# Altium project Controller_PCB_Project.PrjPCB
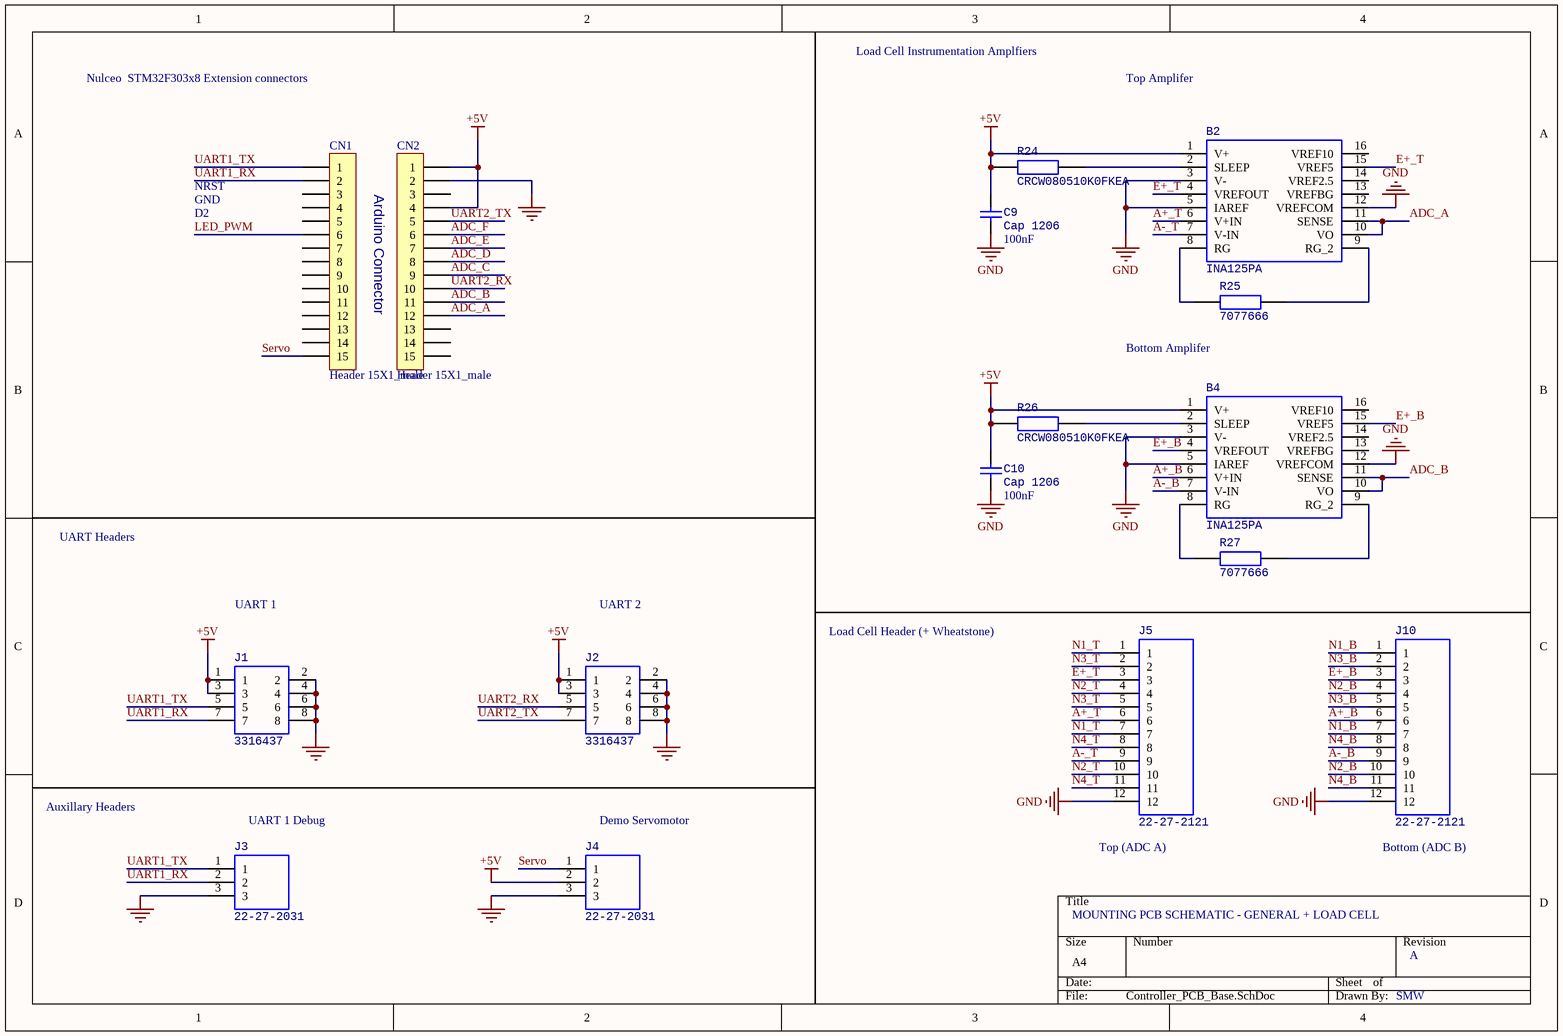
[diagram p0: Controller_PCB_Base.SchDoc]
3 sheets, 75 parts. Net scope: global (net labels, ports and power ports of the same name join across sheets).
Board file: Controller_PCB.PcbDoc
Sheets:
  Controller_PCB_Base.SchDoc
  Controller_PCB_LED.SchDoc
  Controller_PCB_OPAMP.SchDoc

## Sheet Controller_PCB_Base.SchDoc
size A4

### Parts
B2  INA125PA  [DIP254P762X508-16]
B4  INA125PA  [DIP254P762X508-16]
C9  Cap 1206  value 100nF  [C1206]
C10  Cap 1206  value 100nF  [C1206]
CN1  Header 15X1_male  [HDR_1x15_2R54_V_F]
CN2  Header 15X1_male  [HDR_1x15_2R54_V_F]
J1  3316437  [RJ45-8]
J2  3316437  [RJ45-8]
J3  22-27-2031  [SHDR3W64P0X254_1X3_762X580X1170P]
J4  22-27-2031  [SHDR3W64P0X254_1X3_762X580X1170P]
J5  22-27-2121  [HDRV12W64P0X254_1X12_3048X580X1170P]
J10  22-27-2121  [HDRV12W64P0X254_1X12_3048X580X1170P]
R24  CRCW080510K0FKEA  [RESC2012X50N]
R25  7077666  [RESAD1550W58L630D230]
R26  CRCW080510K0FKEA  [RESC2012X50N]
R27  7077666  [RESAD1550W58L630D230]

### Nets
+5V: B2.1(V+) B4.1(V+) C9.2 C10.2 CN2.1 CN2.4 J1.1 J1.3 J2.1 J2.3 J4.2 R24.1 R26.1
GND: B2.3(V-) B2.5(IAREF) B2.12(VREFCOM) B4.3(V-) B4.5(IAREF) B4.12(VREFCOM) C9.1 C10.1 CN2.2 J1.2 J1.4 J1.6 J1.8 J2.2 J2.4 J2.6 J2.8 J3.3 J4.3 J5.12 J10.12
A+_B: B4.6(V+IN) J10.6
A+_T: B2.6(V+IN) J5.6
A-_B: B4.7(V-IN) J10.9
A-_T: B2.7(V-IN) J5.9
ADC_A: B2.10(VO) B2.11(SENSE) CN2.12
ADC_B: B4.10(VO) B4.11(SENSE) CN2.11
ADC_C: CN2.9
ADC_D: CN2.8
ADC_E: CN2.7
ADC_F: CN2.6
E+_B: B4.4(VREFOUT) B4.15(VREF5) J10.3
E+_T: B2.4(VREFOUT) B2.15(VREF5) J5.3
LED_PWM: CN1.6
N1_B: J10.1 J10.7
N1_T: J5.1 J5.7
N2_B: J10.4 J10.10
N2_T: J5.4 J5.10
N3_B: J10.2 J10.5
N3_T: J5.2 J5.5
N4_B: J10.8 J10.11
N4_T: J5.8 J5.11
Servo: CN1.15 J4.1
UART1_RX: CN1.2 J1.7 J3.2
UART1_TX: CN1.1 J1.5 J3.1
UART2_RX: CN2.10 J2.5
UART2_TX: CN2.5 J2.7
NetB2_2: B2.2(SLEEP) R24.2
NetB2_8: B2.8(RG) R25.1
NetB2_9: B2.9(RG_2) R25.2
NetB4_2: B4.2(SLEEP) R26.2
NetB4_8: B4.8(RG) R27.1
NetB4_9: B4.9(RG_2) R27.2

Not connected (* = marked no-connect by the designer): B2 13(VREFBG) 14(VREF2.5) 16(VREF10); B4 13(VREFBG) 14(VREF2.5) 16(VREF10); CN1 3 4 5 7 8 9 10 11 12 13 14; CN2 3 13 14 15

### Notes on the sheet
- Nulceo  STM32F303x8 Extension connectors
- Load Cell Instrumentation Amplfiers
- Top Amplifer
- NRST
- GND
- D2
- Arduino Connector
- Bottom Amplifer
- UART Headers
- UART 1
- UART 2
- Load Cell Header (+ Wheatstone)
- Auxillary Headers
- (near J3) UART 1 Debug
- (near J4) Demo Servomotor
- (near J5) Top (ADC A)
- (near J10) Bottom (ADC B)
- MOUNTING PCB SCHEMATIC - GENERAL + LOAD CELL
- A
- SMW

### Library data of the parts
B2 B4 = INA125PA: Instrumentation Amplifier with Precision Voltage Reference; Manufacturer_Name: Texas Instruments; RS Part Number: 2521593P; Manufacturer_Part_Number: INA125PA; Datasheet Link: http://uk.rs-online.com/web/p/products/2521593P
C9 C10 = Cap Semi: Capacitor (Semiconductor SIM Model); Published: 8-Jun-2000; LatestRevisionDate: 29-May-2009; LatestRevisionNote: IPC-7351 Footprint Added.; PackageReference: C1206; Publisher: Altium Limited; PackageDescription: Chip Capacitor
CN1 CN2 = Header 15X1_Female_1: Header, 10-Pin, Single row,female; LatestRevisionDate: 17-Jul-2002; LatestRevisionNote: Re-released for DXP Platform.; Publisher: Altium Limited
J1 J2 = 3316437: 8/8 way r/a PCB lowprofile data skt,1.5A RS Pro Female Cat5 RJ45 Connector, Unshielded, Right Angle, PCB Mount Mount,; Manufacturer_Name: RS Components; Allied_Number: 70643325; RS Part Number: 3316437; Manufacturer_Part_Number: 3316437; Datasheet Link: http://uk.rs-online.com/web/p/products/3316437
J3 J4 = 22-27-2031: 3way straight PCB header w/friction lock Molex KK Series, Series Number 6410, 2.54mm Pitch 3 Way 1 Row Straight PCB Header, Solder Termination, 4A; Allied_Number: 70190935; Geometry.Height: 11.7mm; RS Part Number: 1707102; Manufacturer_Name: Molex; Manufacturer_Part_Number: 22-27-2031; Datasheet Link: http://uk.rs-online.com/web/p/products/1707102
J5 J10 = 22-27-2121: 12way straightPCB header w/friction lock Molex KK Series, Series Number 6410, 2.54mm Pitch 12 Way 1 Row Straight PCB Header, Solder Termination, 4A; Allied_Number: 70373056; Geometry.Height: 11.7mm; RS Part Number: 1707108; Manufacturer_Name: Molex; Manufacturer_Part_Number: 22-27-2121; Datasheet Link: http://uk.rs-online.com/web/p/products/1707108
R24 R26 = CRCW080510K0FKEA: CRCW0805 Resistor T/R 0.125W,1%,10K Vishay CRCW Series Thick Film Surface Mount Resistor 0805 Case 10k 1% 0.125W 100ppm/C; Allied_Number: 70203987; Geometry.Height: 0.5mm; RS Part Number: 1694499; Manufacturer_Name: Vishay; Manufacturer_Part_Number: CRCW080510K0FKEA; Datasheet Link: http://uk.rs-online.com/web/p/products/1694499
R25 R27 = 7077666: RS Pro RS Series Axial Carbon Resistor 1k 5% 0.25W -500  +350ppm/C; Manufacturer_Name: RS Components; RS Part Number: 7077666; Manufacturer_Part_Number: 7077666; Datasheet Link: https://componentsearchengine.com/Datasheets/3/7077666.pdf

## Sheet Controller_PCB_LED.SchDoc
size A4
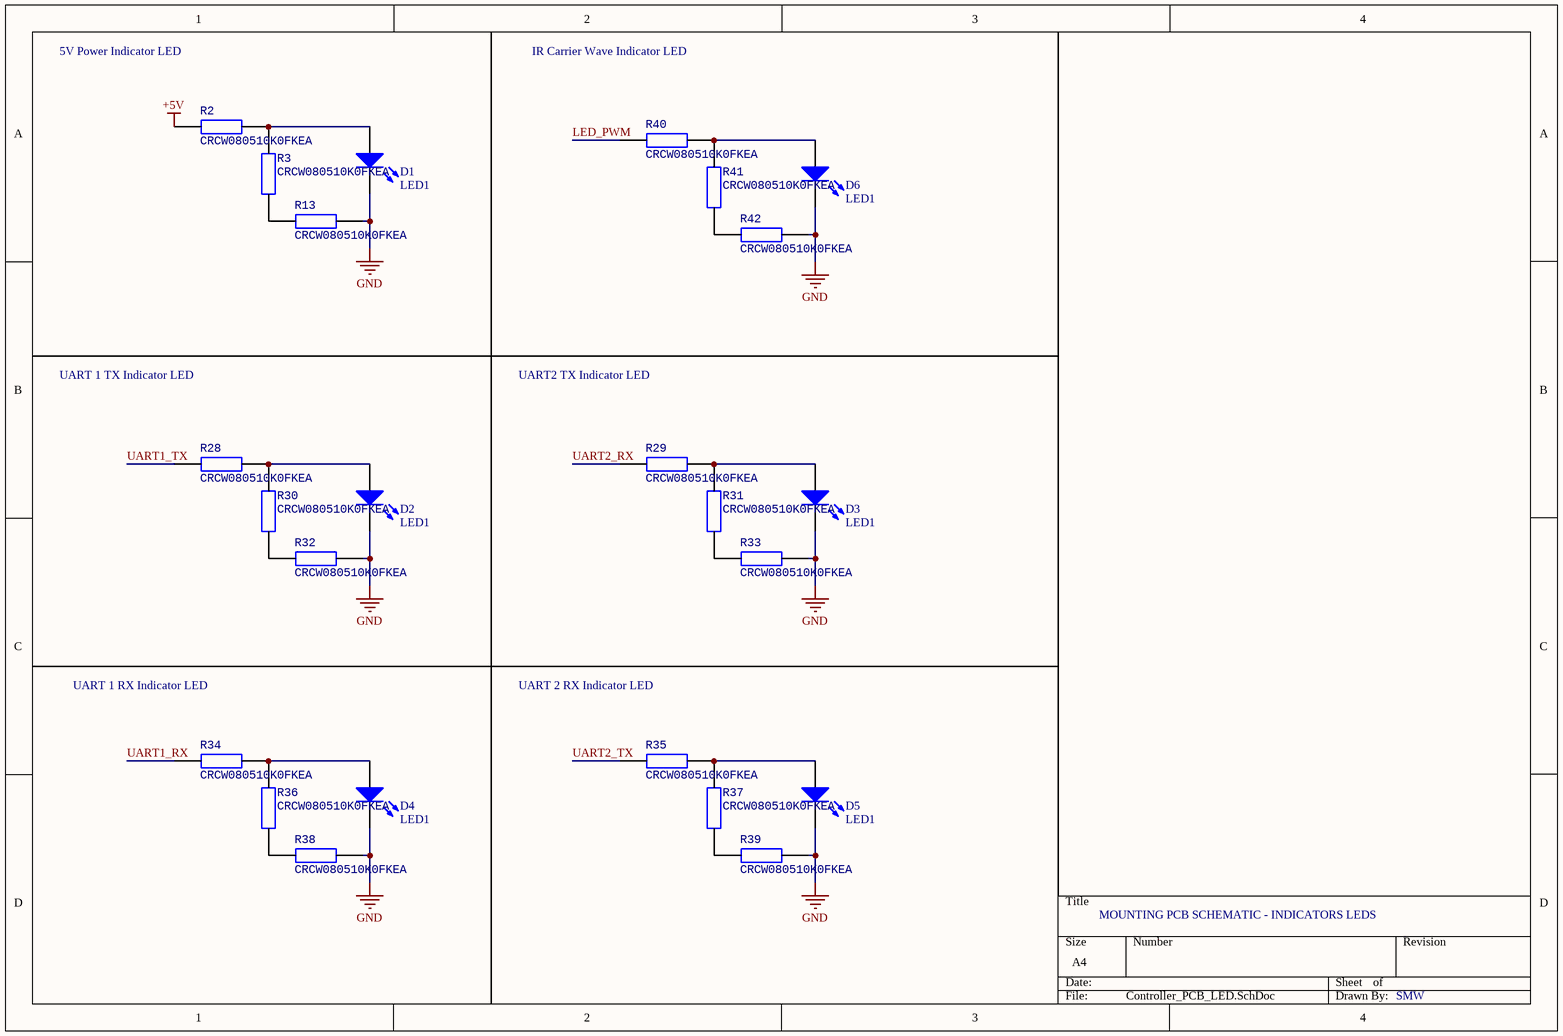
[diagram p1: Controller_PCB_LED.SchDoc]

### Parts
D1  LED1  [L0603]
D2  LED1  [L0603]
D3  LED1  [L0603]
D4  LED1  [L0603]
D5  LED1  [L0603]
D6  LED1  [L0603]
R2  CRCW080510K0FKEA  [RESC2012X50N]
R3  CRCW080510K0FKEA  [RESC2012X50N]
R13  CRCW080510K0FKEA  [RESC2012X50N]
R28  CRCW080510K0FKEA  [RESC2012X50N]
R29  CRCW080510K0FKEA  [RESC2012X50N]
R30  CRCW080510K0FKEA  [RESC2012X50N]
R31  CRCW080510K0FKEA  [RESC2012X50N]
R32  CRCW080510K0FKEA  [RESC2012X50N]
R33  CRCW080510K0FKEA  [RESC2012X50N]
R34  CRCW080510K0FKEA  [RESC2012X50N]
R35  CRCW080510K0FKEA  [RESC2012X50N]
R36  CRCW080510K0FKEA  [RESC2012X50N]
R37  CRCW080510K0FKEA  [RESC2012X50N]
R38  CRCW080510K0FKEA  [RESC2012X50N]
R39  CRCW080510K0FKEA  [RESC2012X50N]
R40  CRCW080510K0FKEA  [RESC2012X50N]
R41  CRCW080510K0FKEA  [RESC2012X50N]
R42  CRCW080510K0FKEA  [RESC2012X50N]

### Nets
+5V: R2.1
GND: D1.2(K) D2.2(K) D3.2(K) D4.2(K) D5.2(K) D6.2(K) R13.1 R32.1 R33.1 R38.1 R39.1 R42.1
LED_PWM: R40.1
UART1_RX: R34.1
UART1_TX: R28.1
UART2_RX: R29.1
UART2_TX: R35.1
NetD1_1: D1.1(A) R2.2 R3.2
NetD2_1: D2.1(A) R28.2 R30.2
NetD3_1: D3.1(A) R29.2 R31.2
NetD4_1: D4.1(A) R34.2 R36.2
NetD5_1: D5.1(A) R35.2 R37.2
NetD6_1: D6.1(A) R40.2 R41.2
NetR3_1: R3.1 R13.2
NetR30_1: R30.1 R32.2
NetR31_1: R31.1 R33.2
NetR36_1: R36.1 R38.2
NetR37_1: R37.1 R39.2
NetR41_1: R41.1 R42.2

### Notes on the sheet
- 5V Power Indicator LED
- IR Carrier Wave Indicator LED
- UART 1 TX Indicator LED
- UART2 TX Indicator LED
- UART 1 RX Indicator LED
- UART 2 RX Indicator LED
- MOUNTING PCB SCHEMATIC - INDICATORS LEDS
- SMW

### Library data of the parts
D1-D6 = LED1: Typical RED GaAs LED; Published: 8-Jun-2000; LatestRevisionDate: 08-Jul-2005; LatestRevisionNote: Mech Layer 1 removed.; PackageReference: LED-1; Publisher: Altium Limited; PackageDescription: LED; 2 Leads
R2 R3 R13 R28-R42 = CRCW080510K0FKEA: as R24 on sheet Controller_PCB_Base; RS Part Number: 1694499; Manufacturer_Name: Vishay; Manufacturer_Part_Number: CRCW080510K0FKEA; Datasheet Link: http://uk.rs-online.com/web/p/products/1694499

## Sheet Controller_PCB_OPAMP.SchDoc
size A4
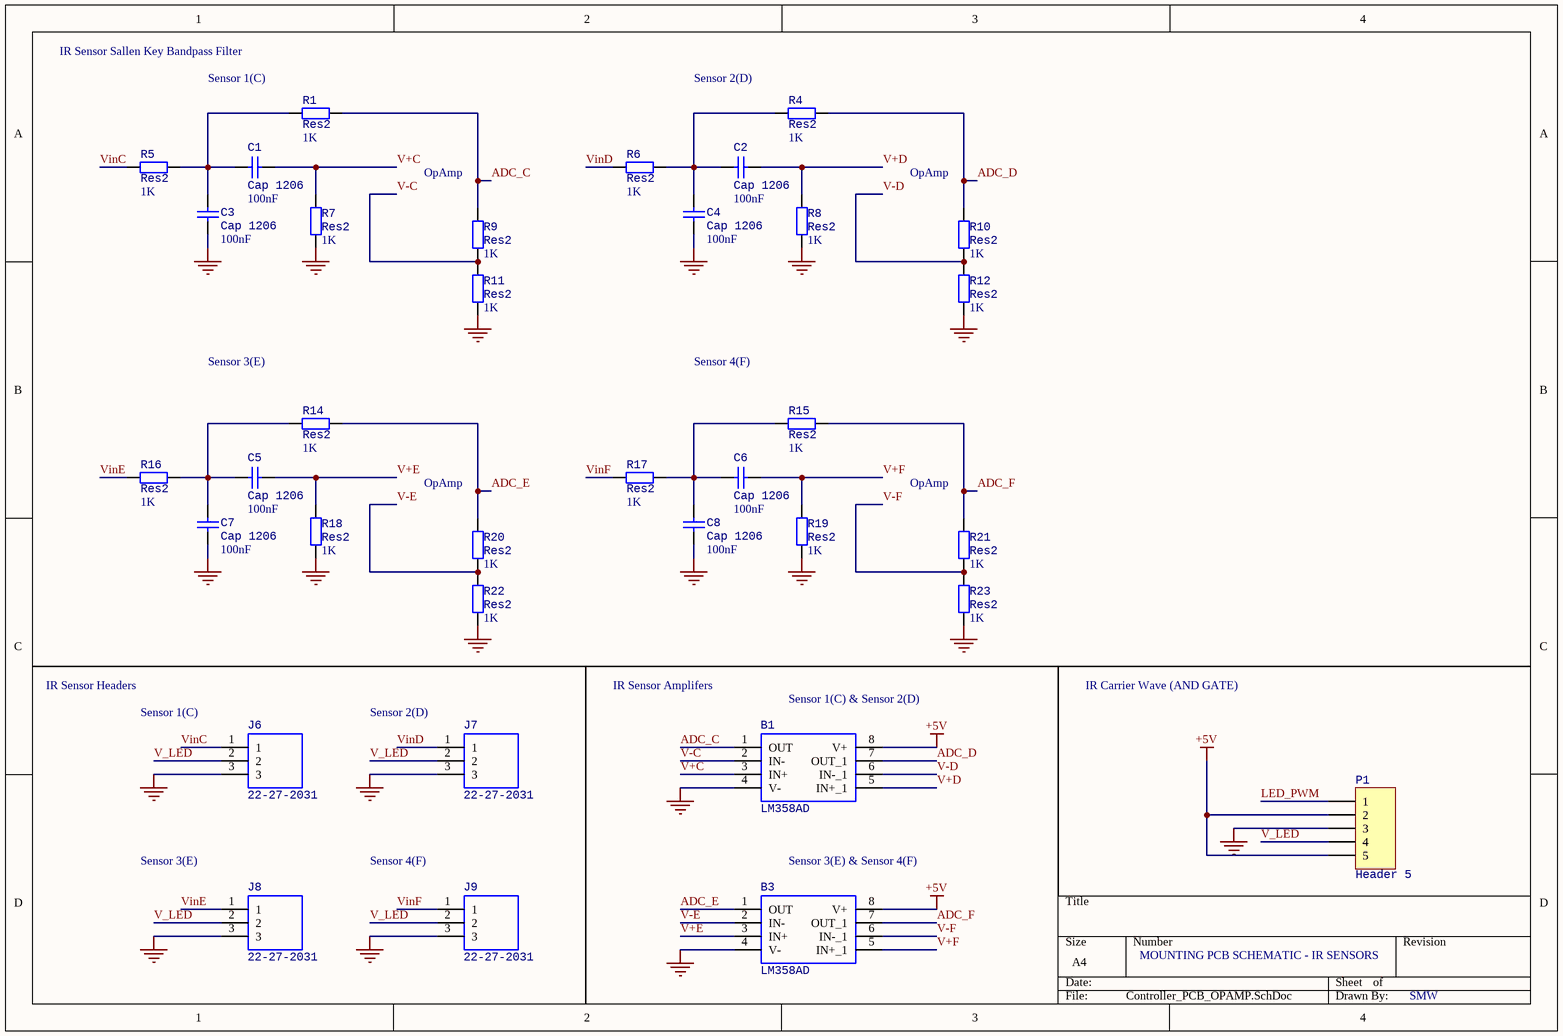
[diagram p2: Controller_PCB_OPAMP.SchDoc]

### Parts
B1  LM358AD  [SOIC127P600X175-8N]
B3  LM358AD  [SOIC127P600X175-8N]
C1  Cap 1206  value 100nF  [C1206]
C2  Cap 1206  value 100nF  [C1206]
C3  Cap 1206  value 100nF  [C1206]
C4  Cap 1206  value 100nF  [C1206]
C5  Cap 1206  value 100nF  [C1206]
C6  Cap 1206  value 100nF  [C1206]
C7  Cap 1206  value 100nF  [C1206]
C8  Cap 1206  value 100nF  [C1206]
J6  22-27-2031  [SHDR3W64P0X254_1X3_762X580X1170P]
J7  22-27-2031  [SHDR3W64P0X254_1X3_762X580X1170P]
J8  22-27-2031  [SHDR3W64P0X254_1X3_762X580X1170P]
J9  22-27-2031  [SHDR3W64P0X254_1X3_762X580X1170P]
P1  Header 5  [SOT353-1]
R1  Res2  value 1K  [C1206]
R4  Res2  value 1K  [C1206]
R5  Res2  value 1K  [C1206]
R6  Res2  value 1K  [C1206]
R7  Res2  value 1K  [C1206]
R8  Res2  value 1K  [C1206]
R9  Res2  value 1K  [C1206]
R10  Res2  value 1K  [C1206]
R11  Res2  value 1K  [C1206]
R12  Res2  value 1K  [C1206]
R14  Res2  value 1K  [C1206]
R15  Res2  value 1K  [C1206]
R16  Res2  value 1K  [C1206]
R17  Res2  value 1K  [C1206]
R18  Res2  value 1K  [C1206]
R19  Res2  value 1K  [C1206]
R20  Res2  value 1K  [C1206]
R21  Res2  value 1K  [C1206]
R22  Res2  value 1K  [C1206]
R23  Res2  value 1K  [C1206]

### Nets
+5V: B1.8(V+) B3.8(V+) P1.2 P1.5
GND: B1.4(V-) B3.4(V-) C3.1 C4.1 C7.1 C8.1 J6.3 J7.3 J8.3 J9.3 P1.3 R7.1 R8.1 R11.1 R12.1 R18.1 R19.1 R22.1 R23.1
ADC_C: B1.1(OUT) R1.2 R9.2
ADC_D: B1.7(OUT_1) R4.2 R10.2
ADC_E: B3.1(OUT) R14.2 R20.2
ADC_F: B3.7(OUT_1) R15.2 R21.2
LED_PWM: P1.1
V+C: B1.3(IN+) C1.1 R7.2
V+D: B1.5(IN+_1) C2.1 R8.2
V+E: B3.3(IN+) C5.1 R18.2
V+F: B3.5(IN+_1) C6.1 R19.2
V-C: B1.2(IN-) R9.1 R11.2
V-D: B1.6(IN-_1) R10.1 R12.2
V-E: B3.2(IN-) R20.1 R22.2
V-F: B3.6(IN-_1) R21.1 R23.2
V_LED: J6.2 J7.2 J8.2 J9.2 P1.4
VinC: J6.1 R5.1
VinD: J7.1 R6.1
VinE: J8.1 R16.1
VinF: J9.1 R17.1
NetC1_2: C1.2 C3.2 R1.1 R5.2
NetC2_2: C2.2 C4.2 R4.1 R6.2
NetC5_2: C5.2 C7.2 R14.1 R16.2
NetC6_2: C6.2 C8.2 R15.1 R17.2

### Notes on the sheet
- IR Sensor Sallen Key Bandpass Filter
- (near R1) Sensor 1(C)
- (near R4) Sensor 2(D)
- (near R9) OpAmp
- (near R10) OpAmp
- Sensor 3(E)
- Sensor 4(F)
- (near R20) OpAmp
- (near R21) OpAmp
- IR Sensor Headers
- (near J6) Sensor 1(C)
- (near J7) Sensor 2(D)
- IR Sensor Amplifers
- (near B1) Sensor 1(C) & Sensor 2(D)
- IR Carrier Wave (AND GATE)
- (near J9) Sensor 4(F)
- (near B3) Sensor 3(E) & Sensor 4(F)
- MOUNTING PCB SCHEMATIC - IR SENSORS
- SMW

### Library data of the parts
B1 B3 = LM358AD: LM358AD, Dual Operational Amplifier 1.1MHz 5 to 28V, 8-Pin SO; Manufacturer_Name: STMicroelectronics; Geometry.Height: 1.75mm; RS Part Number: 1657542; Manufacturer_Part_Number: LM358AD; Datasheet Link: http://uk.rs-online.com/web/p/products/1657542
C1-C8 = Cap Semi: Capacitor (Semiconductor SIM Model); Published: 8-Jun-2000; LatestRevisionDate: 29-May-2009; LatestRevisionNote: IPC-7351 Footprint Added.; PackageReference: C1206; Publisher: Altium Limited; PackageDescription: Chip Capacitor
J6-J9 = 22-27-2031: as J3 on sheet Controller_PCB_Base; RS Part Number: 1707102; Manufacturer_Name: Molex; Manufacturer_Part_Number: 22-27-2031; Datasheet Link: http://uk.rs-online.com/web/p/products/1707102
P1 = Header 5: Header, 5-Pin; LatestRevisionDate: 17-Jul-2002; LatestRevisionNote: Re-released for DXP Platform.; Publisher: Altium Limited
R1 R4-R12 R14-R23 = Res2: Resistor; Published: 8-Jun-2000; LatestRevisionDate: 17-Jul-2002; LatestRevisionNote: Re-released for DXP Platform.; PackageReference: AXIAL-0.4; Publisher: Altium Limited; PackageDescription: Axial Device, Thru-Hole; 2 Leads; 0.4 in Pin Spacing

## Nets that join several sheets
+5V: Controller_PCB_Base (13 pins), Controller_PCB_LED (R2.1), Controller_PCB_OPAMP (B1.8 B3.8 P1.2 P1.5)
GND: Controller_PCB_Base (21 pins), Controller_PCB_LED (12 pins), Controller_PCB_OPAMP (19 pins)
ADC_C: Controller_PCB_Base (CN2.9), Controller_PCB_OPAMP (B1.1 R1.2 R9.2)
ADC_D: Controller_PCB_Base (CN2.8), Controller_PCB_OPAMP (B1.7 R4.2 R10.2)
ADC_E: Controller_PCB_Base (CN2.7), Controller_PCB_OPAMP (B3.1 R14.2 R20.2)
ADC_F: Controller_PCB_Base (CN2.6), Controller_PCB_OPAMP (B3.7 R15.2 R21.2)
LED_PWM: Controller_PCB_Base (CN1.6), Controller_PCB_LED (R40.1), Controller_PCB_OPAMP (P1.1)
UART1_RX: Controller_PCB_Base (CN1.2 J1.7 J3.2), Controller_PCB_LED (R34.1)
UART1_TX: Controller_PCB_Base (CN1.1 J1.5 J3.1), Controller_PCB_LED (R28.1)
UART2_RX: Controller_PCB_Base (CN2.10 J2.5), Controller_PCB_LED (R29.1)
UART2_TX: Controller_PCB_Base (CN2.5 J2.7), Controller_PCB_LED (R35.1)